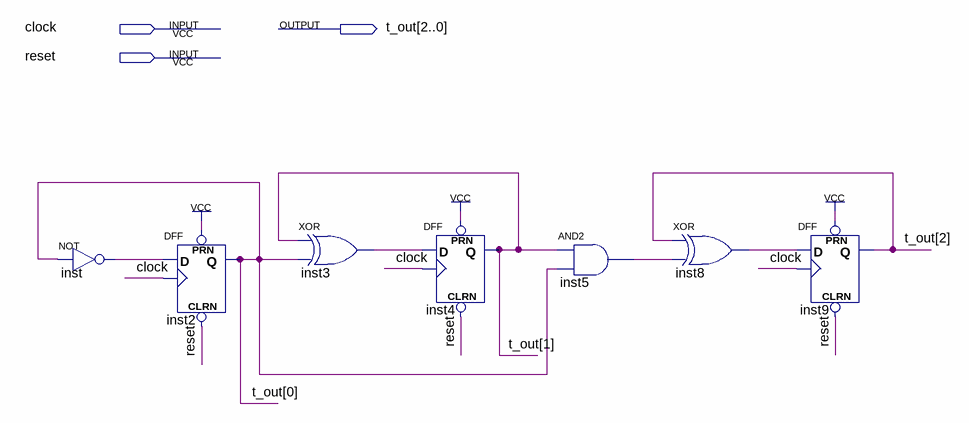
[diagram p0: schematic sheet]
// Quartus schematic Counter_3bits.bdf as structural Verilog: 7 symbols, 3 pins
module Counter_3bits (
  input  clock,
  input  reset,
  output [2:0] t_out
);

  wire inst3_out, inst5_out, inst8_out, inst_out;

  not inst (inst_out, t_out[0]);
  DFF inst2 (.CLRN(reset), .CLK(clock), .D(inst_out), .PRN(1'b1), .Q(t_out[0]));
  xor inst3 (inst3_out, t_out[1], t_out[0]);
  DFF inst4 (.CLRN(reset), .CLK(clock), .D(inst3_out), .PRN(1'b1), .Q(t_out[1]));
  and inst5 (inst5_out, t_out[1], t_out[0]);
  xor inst8 (inst8_out, t_out[2], inst5_out);
  DFF inst9 (.CLRN(reset), .CLK(clock), .D(inst8_out), .PRN(1'b1), .Q(t_out[2]));
endmodule
